# EAGLE design DAWA-MPU 6.3 (EAGLE 9.5.0)
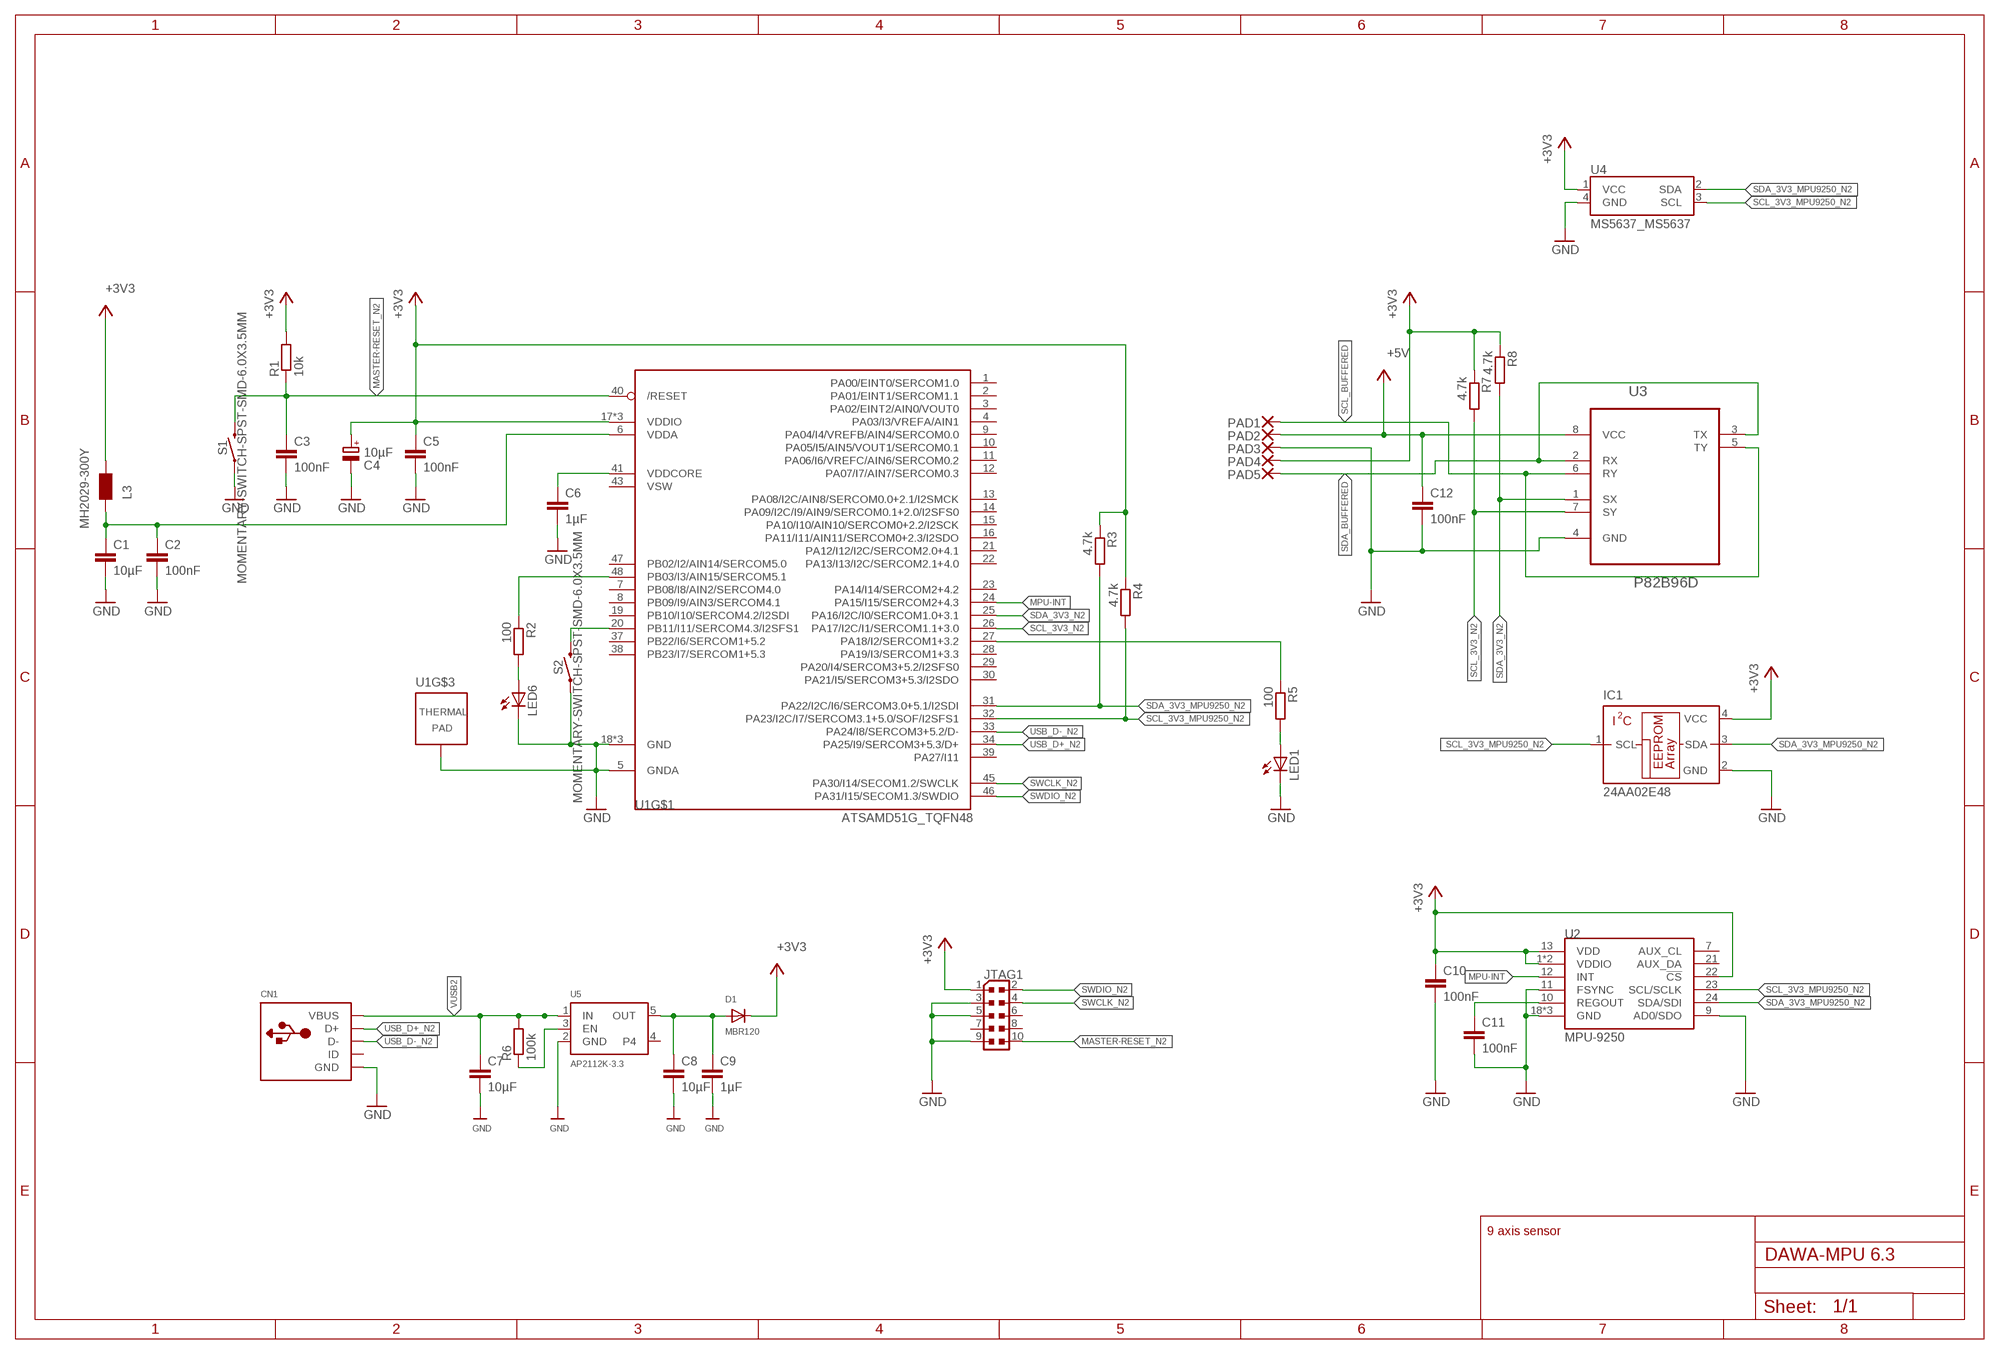
[diagram p0: schematic, sheet 1]

## Parts
C1  10µF  C-EUC0805  [C0805]
C2  100nF  C-EUC0603  [C0603]
C3  100nF  C-EUC0603  [C0603]
C4  10µF  CPOL-EUSMCB  [SMC_B]
C5  100nF  C-EUC0603  [C0603]
C6  1µF  C-EUC0603  [C0603]
C7  10µF  C-EUC0603  [C0603]
C8  10µF  C-EUC0603  [C0603]
C9  1µF  C-EUC0603  [C0603]
C10  100nF  C-EUC0603  [C0603]
C11  100nF  C-EUC0603  [C0603]
C12  100nF  C-EUC0603  [C0603]
CN1  USB  [USB-MINIB-DAWA]
D1  MBR120  DIODE_SOD-123FL  [SOD-123FL]
IC1  24AA02E48  24AA00OT  [SOT23-5L]
JTAG1  PINHEAD_PINHD-2X5PASSO127  [PINHEAD_2X05_127]
L3  MH2029-300Y  WE-CBF_0805  [0805]
LED1  LEDCHIPLED_1206  [CHIPLED_1206]
LED6  LEDCHIPLED_1206  [CHIPLED_1206]
PAD1  WIREPAD1,6/0,9  [1,6/0,9]
PAD2  WIREPAD1,6/0,9  [1,6/0,9]
PAD3  WIREPAD1,6/0,9  [1,6/0,9]
PAD4  WIREPAD1,6/0,9  [1,6/0,9]
PAD5  WIREPAD1,6/0,9  [1,6/0,9]
R1  10k  R-EU_R0603  [R0603]
R2  100  R-EU_R0603  [R0603]
R3  4.7k  R-EU_R0603  [R0603]
R4  4.7k  R-EU_R0603  [R0603]
R5  100  R-EU_R0603  [R0603]
R6  100k  R-EU_R0603  [R0603]
R7  4.7k  R-EU_R0603  [R0603]
R8  4.7k  R-EU_R0603  [R0603]
S1  MOMENTARY-SWITCH-SPST-SMD-6.0X3.5MM  [TACTILE_SWITCH_SMD_6.0X3.5MM]
S2  MOMENTARY-SWITCH-SPST-SMD-6.0X3.5MM  [TACTILE_SWITCH_SMD_6.0X3.5MM]
U1  ATSAMD51G_TQFN48  [TQFN48_7MM]
U2  MPU-9250  [QFN24_PAD]
U3  P82B96D  [SOIC127P600X175-8N]
U4  MS5637_MS5637  [MS5637_MS5637]
U5  AP2112K-3.3  VREG_SOT23-5  [SOT23-5]

## Nets
+3V1: R2.1 U1.48(PB03/I3/AIN15/SERCOM5.1)
+3V2: R5.1 U1.27(PA18/I2/SERCOM1+3.2)
+3V3: C4.+ C5.1 C10.1 D1.C IC1.4(VCC) JTAG1.1 L3.1 PAD4.1(P) R1.2 R3.1 R4.1 R7.1 R8.1 U1.17(VDDIO) U1.36(VDDIO) U1.44(VDDIO) U2.1(VDDIO) U2.8(VDDIO) U2.13(VDD) U2.22(!CS) U4.1(VCC)
+5V: C12.1 PAD2.1(P) U3.8(VCC)
GND: C1.2 C2.2 C3.2 C4.- C5.2 C6.2 C7.2 C8.2 C9.2 C10.2 C11.2 C12.2 CN1.GND CN1.GND1(GND) CN1.GND2(GND) IC1.2(GND) JTAG1.3 JTAG1.5 JTAG1.9 LED1.C LED6.C PAD3.1(P) S1.1 S2.1 U1.5(GNDA) U1.18(GND) U1.35(GND) U1.42(GND) U1.THERMAL(TP) U2.9(AD0/SDO) U2.11(FSYNC) U2.18(GND) U2.20(GND) U2.CENTER(GND) U3.4(GND) U4.4(GND) U5.2(GND)
MASTER-RESET_N2: C3.1 JTAG1.10 R1.1 S1.2 U1.40(/RESET)
MPU-INT: U1.24(PA15/I15/SERCOM2+4.3) U2.12(INT)
N$1: LED1.A R5.2
N$9: C6.1 U1.41(VDDCORE)
N$16: S2.2 U1.20(PB11/I11/SERCOM4.3/I2SFS1)
N$17: LED6.A R2.2
N$47: R6.1 U5.3(EN)
OUT: C8.1 C9.1 D1.A U5.5(OUT)
REGOUT: C11.1 U2.10(REGOUT)
SCL_3V3_MPU9250_N2: IC1.1(SCL) R4.2 U1.32(PA23/I2C/I7/SERCOM3.1+5.0/SOF/I2SFS1) U2.23(SCL/SCLK) U4.3(SCL)
SCL_3V3_N2: R7.2 U1.26(PA17/I2C/I1/SERCOM1.1+3.0) U3.7(SY)
SCL_BUFFERED: PAD1.1(P) U3.5(TY) U3.6(RY)
SDA_3V3_MPU9250_N2: IC1.3(SDA) R3.2 U1.31(PA22/I2C/I6/SERCOM3.0+5.1/I2SDI) U2.24(SDA/SDI) U4.2(SDA)
SDA_3V3_N2: R8.2 U1.25(PA16/I2C/I0/SERCOM1.0+3.1) U3.1(SX)
SDA_BUFFERED: PAD5.1(P) U3.2(RX) U3.3(TX)
SWCLK_N2: JTAG1.4 U1.45(PA30/I14/SECOM1.2/SWCLK)
SWDIO_N2: JTAG1.2 U1.46(PA31/I15/SECOM1.3/SWDIO)
USB_D+_N2: CN1.D+ U1.34(PA25/I9/SERCOM3+5.3/D+)
USB_D-_N2: CN1.D- U1.33(PA24/I8/SERCOM3+5.2/D-)
VDDANA1: C1.1 C2.1 L3.2 U1.6(VDDA)
VUSB2: C7.1 CN1.VBUS R6.2 U5.1(IN)
Unconnected: CN1.ID JTAG1.6 JTAG1.7 JTAG1.8 U1.1(PA00/EINT0/SERCOM1.0) U1.2(PA01/EINT1/SERCOM1.1) U1.3(PA02/EINT2/AIN0/VOUT0) U1.4(PA03/I3/VREFA/AIN1) U1.7(PB08/I8/AIN2/SERCOM4.0) U1.8(PB09/I9/AIN3/SERCOM4.1) U1.9(PA04/I4/VREFB/AIN4/SERCOM0.0) U1.10(PA05/I5/AIN5/VOUT1/SERCOM0.1) U1.11(PA06/I6/VREFC/AIN6/SERCOM0.2) U1.12(PA07/I7/AIN7/SERCOM0.3) U1.13(PA08/I2C/AIN8/SERCOM0.0+2.1/I2SMCK) U1.14(PA09/I2C/I9/AIN9/SERCOM0.1+2.0/I2SFS0) U1.15(PA10/I10/AIN10/SERCOM0+2.2/I2SCK) U1.16(PA11/I11/AIN11/SERCOM0+2.3/I2SDO) U1.19(PB10/I10/SERCOM4.2/I2SDI) U1.21(PA12/I12/I2C/SERCOM2.0+4.1) U1.22(PA13/I13/I2C/SERCOM2.1+4.0) U1.23(PA14/I14/SERCOM2+4.2) U1.28(PA19/I3/SERCOM1+3.3) U1.29(PA20/I4/SERCOM3+5.2/I2SFS0) U1.30(PA21/I5/SERCOM3+5.3/I2SDO) U1.37(PB22/I6/SERCOM1+5.2) U1.38(PB23/I7/SERCOM1+5.3) U1.39(PA27/I11) U1.47(PB02/I2/AIN14/SERCOM5.0) U2.7(AUX_CL) U2.21(AUX_DA) U5.4

## Notes on the sheet
- 9 axis sensor

## Power pins joined to a net without a drawn wire
VSW: U1.43(VSW)

## Library data of the parts
C1-C3 C5-C11 = rcl:C-EU: CAPACITOR, European symbol; SPICEPREFIX: C
C4 = rcl:CPOL-EU: POLARIZED CAPACITOR, European symbol; SPICEPREFIX: C
C12 = rcl:C-EU: CAPACITOR, European symbol
CN1 = DAWA:USB: USB Connectors USBMINIB - Surface Mount Female Mini-B USB Connector 4UConnector: 06564 By microbuilder.eu Thru-hole RA Female Mini-B USB Connector 4UConnector: 18732 By ladyada.net
D1 = adafruit:DIODE: Diode SMADIODE - SMA Surface Mount Package 20V 1A Schottky Diode Digikey: 641-1014-6-ND DO-1N4148 - Through Hole Small Current Diode SOD-123 20V 1 A (.5mV Vf) Schottky Diode - Digikey: MBRX120TPMSCT-ND SOD-323 10V 570mA (.38mV Vf, 3ns) Schottky Diode - Digikey: ZLLS410CT-ND SOD-523 30V 30mA Schottky Diode (RB751S-40TE61) - Digikey: RB751S-40TE61CT-ND SOT23-R/W - SOT23 Package (R = Solder Paste/Reflow Ovens, W = Hand-Soldering) BAT54Film 40V 300mA - Digikey: 497-7162-1-ND
IC1 = microchip:24*00: Serial EEPROM 128 bit, I2C (AA = 1.8 V/LC = 2.5 V/C = 5.0 V); MF: MICROCHIP; MPN: 24AA00T-I/OTG; OC_FARNELL: 1331264; OC_NEWARK: 89H3038
JTAG1 = Arduino_Wifi_shield_v018_tG:PINHEAD_PINHD-2X5: PIN HEADER
L3 = wuerth-elektronik:WE-CBF: SMD EMI Suppression Ferrite Beads - excellent anti-EMI properties - low DCR - impedances till 3000 ohms - rated current up to 6 A
LED1 LED6 = adafruit:LED: LED OSRAM: - CHIPLED LG R971, LG N971, LY N971, LG Q971, LY Q971, LO R971, LY R971 LH N974, LH R974 LS Q976, LO Q976, LY Q976 LO Q996 - Hyper CHIPLED LW Q18S LB Q993, LB Q99A, LB R99A - SideLED LS A670, LO A670, LY A670, LG A670, LP A670 LB A673, LV A673, LT A673, LW A673 LH A674 LY A675 LS A676, LA A676, LO A676, LY A676, LW A676 LS A679, LY A679, LG A679 - Hyper Micro SIDELED® LS Y876, LA Y876, LO Y876, LY Y876 LT Y87S - SmartLED LW L88C, LW L88S LB L89C, LB L89S, LG L890 LS L89K, LO L89K, LY L89K LS L896, LA L896, LO L896, LY L896 - TOPLED LS T670, LO T670, LY T670, LG T670, LP T670 LSG T670, LSP T670, LSY T670, LOP T670, LYG T670 LG T671, LOG T671, LSG T671 LB T673, LV T673, LT T673, LW T673 LH T674 LS T676, LA T676, LO T676, LY T676, LB T676, LH T676, LSB T676, LW T676 LB T67C, LV T67C, LT T67C, LS T67K, LO T67K, LY T67K, LW E67C LS E67B, LA E67B, LO E67B, LY E67B, LB E67C, LV E67C, LT E67C LW T67C LS T679, LY T679, LG T679 LS T770, LO T770, LY T770, LG T770, LP T770 LB T773, LV T773, LT T773, LW T773 LH T774 LS E675, LA E675, LY E675, LS T675 LS T776, LA T776, LO T776, LY T776, LB T776 LHGB T686 LT T68C, LB T68C - Hyper Mini TOPLED® LB M676 - Mini TOPLED Santana® LG M470 LS M47K, LO M47K, LY M47K Source: http://www.osram.convergy.de/
PAD1-PAD5 = wirepad:WIREPAD: Wire PAD connect wire on PCB
R1 R6 = rcl:R-EU_: RESISTOR, European symbol; SPICEPREFIX: R
R2-R5 R7 R8 = resistor:R-EU_: RESISTOR, European symbol
S1 S2 = SparkFun-Switches:MOMENTARY-SWITCH-SPST: Momentary Switch (Pushbutton) - SPST Normally-open (NO) SPST momentary switches (buttons, pushbuttons). Variants PTH-12MM - 12mm square, through-hole Momentary Pushbutton Switch - 12mm Square <https://www.sparkfun.com/products/9190> (COM-09190) PTH-6.0MM, PTH-6.0MM-KIT - 6.0mm square, through-hole Mini Pushbutton Switch <https://www.sparkfun.com/products/97> (COM-00097) KIT package intended for soldering kit's - only one side of pads' copper is exposed. PTH-RIGHT-ANGLE-KIT - Right-angle, through-hole Right Angle Tactile Button <https://www.sparkfun.com/products/10791> - Used on SparkFun BigTime Watch Kit <https://www.sparkfun.com/products/11734> SMD-12MM - 12mm square, surface-mount Tactile Button - SMD (12mm) <https://www.sparkfun.com/products/12993> (COM-12993) Used on SparkFun PicoBoard <https://www.sparkfun.com/products/11888> SMD-4.5MM - 4.5mm Square Trackball Switch Used on SparkFun Blackberry Trackballer Breakout <https://www.sparkfun.com/products/13169> SMD-4.6MMX2.8MM - 4.60mm x 2.80mm, surface mount Used on SparkFun SAMD21 Mini Breakout <https://www.sparkfun.com/products/13664> SMD-5.2MM, SMD-5.2-REDUNDANT - 5.2mm square, surface-mount Mini Pushbutton Switch - SMD <https://www.sparkfun.com/products/8720> (COM-08720) Used on Arduino Pro Mini <https://www.sparkfun.com/products/11114> REDUNDANT package connects both switch circuits together SMD-6.0X3.5MM - 6.0 x 3.5mm, surface mount Momentary Reset Switch SMD <https://www.sparkfun.com/products/8229> (COM-08229) SMD-6.2MM-TALL - 6.2mm square, surface mount Tactile Button - SMD (6mm) <https://www.sparkfun.com/products/12992> Used on SparkFun Digital Sandbox <https://www.sparkfun.com/products/12651> SMD-RIGHT-ANGLE - Right-angle, surface mount Used on SparkFun Block for Intel® Edison - Arduino <https://www.sparkfun.com/products/13036>; PROD_ID: SWCH-00815; SF_SKU: COM-08229
U1 = microbuilder:ATSAMD51G
U2 = Testing:MPU-9250: NC pin 19. 2-6 & 14-17 not internally connected. May be used for PCB trace routing.; PROD_ID: IC-13192
U3 = TI:P82B96D: DUAL BIDIRECTIONAL BUS BUFFER; MPN: P82B96D; OC_FARNELL: 1831235; OC_NEWARK: 88K6383; PACKAGE: SOIC-8; SUPPLIER: Texas Instruments
U4 = MS5637:MS5637_MS5637
U5 = microbuilder:VREG_SOT23-5: SOT23-5 Fixed Voltage Regulators Part Current Out V Out V In V Dropout θJA (°C/W) TJ (°C) Digikey Part No. ADP121 150mA 3.3V 3.4-5.5V 0.09V @ 150mA -- -- ADP121-AUJZ33R7CT-ND ADP121 150mA 3.0V 3.1-5.5V 0.09V @ 150mA -- -- ADP121-AUJZ30R7CT-ND ADP122 300mA 3.3V 3.4-5.5V 0.085V @ 300mA -- -- ADP122AUJZ-3.3-R7CT-ND ADP1712 300mA 3.3V 3.5-5.5V 0.17V @ 300mA -- -- ADP1712AUJZ-3.3-R7TR-ND AP7311 (Low Cost) 150mA 3.3V 3.5-6V 0.15V @ 150mA -- -- AP7311-33WG-7DICT-ND LD39015M18R 150mA 1.8V 1.9V-5.5V 0.08V @ 100mA -- -- 497-6977-1-ND LP2985A-33DBVR 150mA 3.3V 3.3-16V 0.28V @ 150mA 206 150 296-18479-1-ND MCP1824T-3302E/OT 300mA 3.3V 3.5V-6V 0.2V @ 300mA -- -- MCP1824T-3302E/OTCT-ND MIC5205-2.5YM5 TR 150mA 2.5V 2.7-16V 0.165V @ 150mA -- -- 576-1257-2-ND MIC5205-3.0YM5 TR 150mA 3.0V 3.2V-16V 0.165V @ 150mA -- -- 576-1258-2-ND MIC5205-3.3YM5 TR 150mA 3.3V 3.5V-16V 0.165V @ 150mA -- -- 576-1259-2-ND TPS780330220 150mA 3.3V+2.2V 3.6-5.5V 250mV Max -- -- 296-23332-1-ND TDA3663/N1,135 100mA 3.3V 3.5-45V 0.18V @ 50mA -- -- 568-5343-1-ND Max operating temp can be calculated using θJA, TJ (max junction temperature), and power in watts. Set the "Maximum Ambient Temperature" until it reaches TJ ("Max Junction Temperature"), which is the absolute limit for safe use of the regulator: Heat Sink Temperature Calculator <http://www.daycounter.com/Calculators/Heat-Sink-Temperature-Calculator.phtml> For example, With 12V source into a 3.3V LP2985 and a 30mA load, we are dissipating (12V-3.3V) * 0.03A = 0.261W. With a θJA of 206 °C/W, a TJ of 150°C, and 261mW we can safely use the chip without a heat sink up to 75°C (=147.1°C Junction Temperature).

## Net classes
0 default: width 0.203 mm, drill 0.406 mm, clearance 0.203 mm
3 usbvcc: width 0.203 mm, drill 0.406 mm, clearance 0.203 mm
4 USBpair: width 0.254 mm, drill 0.406 mm, clearance 0.61 mm

## Board
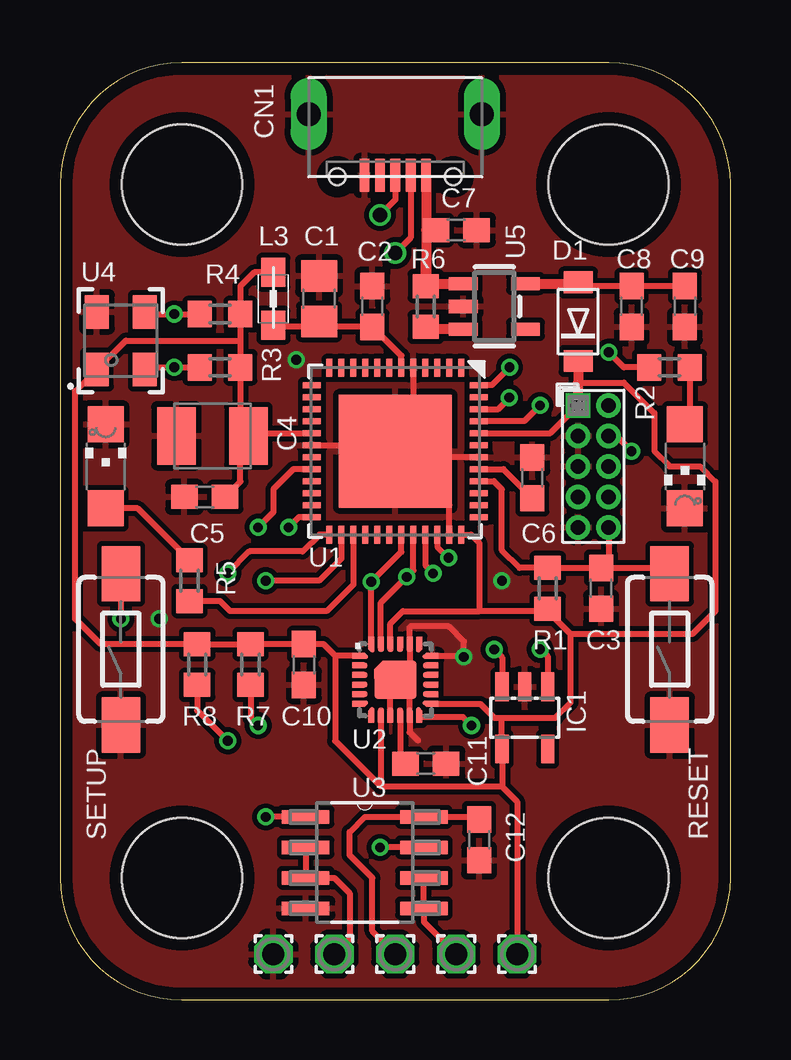
[diagram p1: board, top side]
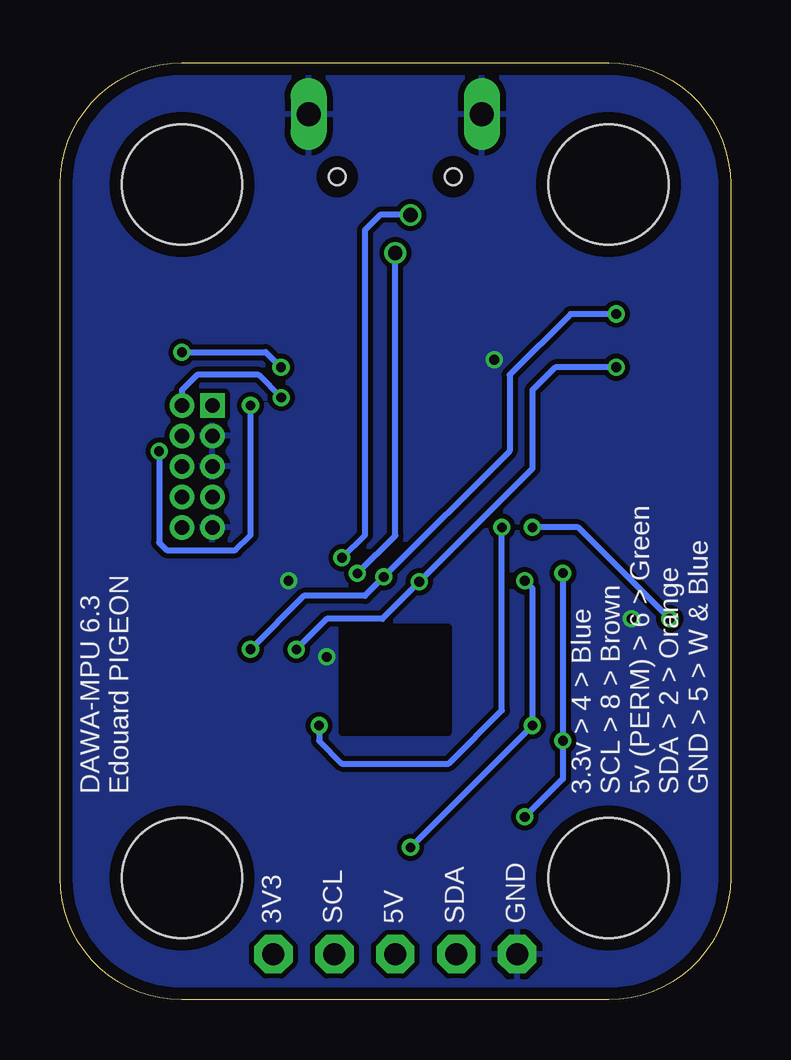
[diagram p2: board, bottom side, seen from below]

Size 27.94 x 39.05 mm. Coordinates in mm from the lower left corner, seen from the top.
Outline: 5.08,39.05 arc90 0,33.97 0,5.08 arc90 5.08,0 22.86,0 arc90 27.94,5.08 27.94,33.97 arc90 22.86,39.05 5.08,39.05
Copper layers (1*16): Top 0.035mm / dielectric 1.6mm / Bottom 0.035mm
Design rules "Elecrow_2-layer_PCB_eagle_rule": minimum track width 6mil, minimum drill 12mil, track to track 6mil, track to pad 6mil, pad to pad 6mil, via to via 8mil, smd to smd 0mil, copper to edge 20mil, drill to drill 10mil, minimum pad ring 6mil, minimum via ring 6mil, stop-mask expansion 0mil, vias tented up to drill 100mil, thermal gap 10mil
Holes 5 mm at 22.86,33.97 5.08,33.97 22.86,5.08 5.08,5.08

### Footprints (pad centres in the part's own frame; a part is rotated, then mirrored left to right if it is on the bottom)
C0805 = smd 1.3 x 1.5: 1 -0.95,0; 2 0.95,0
C0603 = smd 1.1 x 1: 1 -0.85,0; 2 0.85,0
SMC_B = smd 1.6 x 2.4: + -1.5,0; - 1.5,0
USB-MINIB-DAWA = smd 0.406 x 1.372: D+ 0,4.381; D- -0.641,4.381; GND 1.282,4.381; ID 0.641,4.381; VBUS -1.282,4.381 | drill 1 long: GND1 -3.612,1.826; GND2 3.612,1.826 | hole 0.7: -2.421,4.445; 2.421,4.445
SOD-123FL = smd 0.91 x 1.22: A 1.637,0; C -1.637,0
SOT23-5L = smd 0.55 x 1.2: 1 -0.95,-1.3; 2 0,-1.3; 3 0.95,-1.3; 4 0.95,1.3; 5 -0.95,1.3
PINHEAD_2X05_127 = drill 0.6 pad 1.016 square: 1 -0.635,2.54 | drill 0.6 pad 1.016: 2 0.635,2.54; 3 -0.635,1.27; 4 0.635,1.27; 5 -0.635,0; 6 0.635,0; 7 -0.635,-1.27; 8 0.635,-1.27; 9 -0.635,-2.54; 10 0.635,-2.54
0805 = smd 1.2 x 1: 1 -1.1,0; 2 1.1,0
CHIPLED_1206 = smd 1.5 x 1.5: A 0,-1.75; C 0,1.75
1,6/0,9 = drill 0.914 pad 1.6 octagon: 1 0,0
R0603 = smd 1 x 1.1: 1 -0.85,0; 2 0.85,0
TACTILE_SWITCH_SMD_6.0X3.5MM = smd 2.3 x 1.6: 1 -3.15,0; 2 3.15,0
TQFN48_7MM = smd 0.25 x 0.75: 1 -2.75,-3.475; 2 -2.25,-3.475; 3 -1.75,-3.475; 4 -1.25,-3.475; 5 -0.75,-3.475; 6 -0.25,-3.475; 7 0.25,-3.475; 8 0.75,-3.475; 9 1.25,-3.475; 10 1.75,-3.475; 11 2.25,-3.475; 12 2.75,-3.475; 25 2.75,3.475; 26 2.25,3.475; 27 1.75,3.475; 28 1.25,3.475; 29 0.75,3.475; 30 0.25,3.475; 31 -0.25,3.475; 32 -0.75,3.475; 33 -1.25,3.475; 34 -1.75,3.475; 35 -2.25,3.475; 36 -2.75,3.475 | smd 0.75 x 0.25: 13 3.475,-2.75; 14 3.475,-2.25; 15 3.475,-1.75; 16 3.475,-1.25; 17 3.475,-0.75; 18 3.475,-0.25; 19 3.475,0.25; 20 3.475,0.75; 21 3.475,1.25; 22 3.475,1.75; 23 3.475,2.25; 24 3.475,2.75; 37 -3.475,2.75; 38 -3.475,2.25; 39 -3.475,1.75; 40 -3.475,1.25; 41 -3.475,0.75; 42 -3.475,0.25; 43 -3.475,-0.25; 44 -3.475,-0.75; 45 -3.475,-1.25; 46 -3.475,-1.75; 47 -3.475,-2.25; 48 -3.475,-2.75 | smd 4.7 x 4.7: THERMAL 0,0
QFN24_PAD = smd 0.5 x 0.25: 1 -1.55,1; 2 -1.55,0.6; 3 -1.55,0.2; 4 -1.55,-0.2; 5 -1.55,-0.6; 6 -1.55,-1; 13 1.55,-1; 14 1.55,-0.6; 15 1.55,-0.2; 16 1.55,0.2; 17 1.55,0.6; 18 1.55,1 | smd 0.08 x 0.13: 1$1 -1.32,1.06; 1$3 -1.26,0.94; P$33 1.26,-0.94; P$34 1.32,-1.06; P$58 1.26,0.94; P$59 1.32,1.06; P$68 -1.26,-0.94; P$69 -1.32,-1.06 | smd 0.1 x 0.185 rotated 45: 1$2 -1.25,1.024; P$49 1.024,-1.25 | smd 0.14 x 0.14: 1$4 -1.22,0.945; P$23 -0.945,-1.22; P$24 1.22,-0.945; P$36 0.945,1.22; P$51 0.945,-1.22; P$56 1.22,0.945; P$61 -0.945,1.22; P$66 -1.22,-0.945 | smd 0.05 x 0.05: 1$5 -1.175,0.97; P$25 -0.97,-1.175; P$31 1.175,-0.97; P$37 0.97,1.175; P$52 0.97,-1.175; P$57 1.175,0.97; P$62 -0.97,1.175; P$67 -1.175,-0.97 | smd 0.25 x 0.5: 7 -1,-1.55; 8 -0.6,-1.55; 9 -0.2,-1.55; 10 0.2,-1.55; 11 0.6,-1.55; 12 1,-1.55; 19 1,1.55; 20 0.6,1.55; 21 0.2,1.55; 22 -0.2,1.55; 23 -0.6,1.55; 24 -1,1.55 | smd 0.25 x 0.25: CENTER 0,0 | smd 0.4 x 0.4: DBBADFE -0.675,0.24 | smd 0.6 x 1.2: DBBADFE1 -0.575,-0.195 | smd 0.25 x 0.3: P$1 -0.2,1.3; P$3 0.2,1.3; P$5 0.6,1.3; P$11 -0.6,1.3; P$16 0.2,-1.3; P$18 -0.2,-1.3; P$20 -0.6,-1.3; P$26 0.6,-1.3 | smd 0.3 x 0.25: P$2 -1.3,0.2; P$4 -1.3,0.6; P$28 -1.3,-0.2; P$38 -1.3,-0.6; P$40 1.3,0.2; P$42 1.3,-0.2; P$44 1.3,-0.6; P$50 1.3,0.6 | smd 0.1 x 0.185 rotated 225: P$7 1.25,-1.024; P$60 -1.024,1.25 | smd 1.1 x 1.59: P$13 0.325,0 | smd 0.3 x 0.5 rotated 315: P$14 -0.592,0.512 | smd 0.5 x 1.59: P$15 -0.27,0 | smd 0.1 x 0.185 rotated 135: P$22 -1.024,-1.25; P$55 1.25,1.024 | smd 0.13 x 0.08: P$27 -0.94,-1.26; P$29 -1.06,-1.32; P$39 0.94,1.26; P$41 1.06,1.32; P$53 0.94,-1.26; P$54 1.06,-1.32; P$63 -0.94,1.26; P$64 -1.06,1.32 | smd 0.1 x 0.185 rotated 315: P$35 1.024,1.25; P$65 -1.25,-1.024
SOIC127P600X175-8N = smd 1.981 x 0.559: 1 -2.464,1.905; 2 -2.464,0.635; 3 -2.464,-0.635; 4 -2.464,-1.905; 5 2.464,-1.905; 6 2.464,-0.635; 7 2.464,0.635; 8 2.464,1.905
MS5637_MS5637 = smd 1.4 x 1: 1 -1.2,1; 2 -1.2,-1; 3 1.2,-1; 4 1.2,1
SOT23-5 = smd 0.55 x 1.2: 1 -0.95,-1.3; 2 0,-1.3; 3 0.95,-1.3; 4 0.95,1.3; 5 -0.95,1.3

### Placement (x,y rotation side)
C1  10.79,29.21 90 top
C2  13.02,28.89 90 top
C3  22.54,17.14 270 top
C4  6.35,23.5 180 top
C5  6.03,20.95 180 top
C6  19.68,21.75 90 top
C7  16.51,32.07 0 top
C8  23.81,28.89 270 top
C9  26.03,28.89 270 top
C10  10.16,13.97 270 top
C11  15.24,9.84 0 top
C12  17.46,6.67 270 top
CN1  13.97,38.73 180 top
D1  21.59,28.26 90 top
IC1  19.37,11.75 180 top
JTAG1  22.22,22.22 0 top
L3  8.89,29.21 270 top
LED1  1.91,22.22 0 top
LED6  26.03,22.22 180 top
PAD1  16.51,1.91 0 top
PAD2  13.97,1.91 0 top
PAD3  8.89,1.91 0 top
PAD4  19.05,1.91 0 top
PAD5  11.43,1.91 0 top
R1  20.32,17.14 270 top
R2  25.4,26.35 0 top
R3  6.67,26.35 180 top
R4  6.67,28.58 180 top
R5  5.4,17.46 90 top
R6  15.24,28.89 90 top
R7  7.94,13.97 270 top
R8  5.71,13.97 270 top
S1  25.4,14.61 90 top
S2  2.54,14.61 90 top
U1  13.97,22.86 180 top
U2  13.97,13.33 0 top
U3  12.7,5.72 0 top
U4  2.54,27.46 90 top
U5  18.1,28.89 270 top

### Tracks (layer width: path | path; a pad name or v marks a point on that pad's centre or on a via)
+3V1  (via drill 0.41)
  Top 0.254: R2.1 23.49,26.35 v22.86,26.99 | v18.73,26.35 17.99,25.61 U1.48
  Bottom 0.254: v22.86,26.99 19.37,26.99 v18.73,26.35
+3V2
  Top 0.254: U1.27 12.22,17.3 11.11,16.19 7.09,16.19 6.67,16.61 R5.1
+3V3
  Top 0.254: U2.22 13.77,15.67 14.29,16.19 17.46,16.19 | U1.36 17.13,19.39 17.46,19.05 17.46,16.19 | U1.44 20.43,23.61 JTAG1.1 | 21.59,25.72 23.49,25.72 24.77,24.45 24.77,22.86 25.4,22.22 26.67,22.22 27.3,21.59 27.3,16.19 26.35,15.24 21.27,15.24 | 21.27,15.24 21.27,12.38 20.64,11.75 18.41,11.75 | U2.1 11.47,14.33 | 11.47,14.33 10.98,14.82 C10.1 R7.1 R8.1 1.69,14.82 0.63,15.88 0.63,25.36 U4.1 2.74,27.46 7.52,27.46 | 7.52,27.46 R4.1 7.52,29.74 8.08,30.31 L3.1 | 7.52,27.46 R3.1 7.52,23.5 | 7.52,23.5 C4.+ 7.96,23.61 U1.17 | U2.8 13.37,8.89 | 13.37,8.89 18.41,8.89 | 17.46,16.19 20.22,16.19 R1.2 20.32,16.19 21.27,15.24 | C5.1 7.52,21.59 7.52,23.5 | U2.13 17.51,12.33 18.1,11.75 18.41,11.75 | 18.41,11.75 IC1.4 18.42,8.89 18.41,8.89 | 18.41,8.89 19.05,8.25 PAD4.1 | 11.47,14.33 11.47,10.79 13.37,8.89
  Top 0.406: D1.C 21.59,25.72 JTAG1.1
+5V
  Top 0.254: PAD2.1 13.02,2.86 13.02,5.08 12.07,6.03 12.07,6.98 12.7,7.62 U3.8 17.36,7.62 C12.1
GND  (via drill 0.41)
  Top 0.254: U2.CENTER 14.57,13.94 U2.20 14.57,15.52 14.6,15.56 16.19,15.56 16.83,14.92 v16.83,14.29 16.78,14.33 U2.18 | U2.9 13.77,13.14 U2.CENTER | U2.CENTER 14.57,12.73 U2.11 14.57,11.15 14.92,10.8 | U1.5 14.72,23.61 U1.THERMAL | U1.18 13.72,23.11 U1.THERMAL | U1.42 14.22,22.61 U1.THERMAL | U1.35 16.22,20.61 U1.THERMAL
  other vias: 18.41,17.46 9.84,26.67 4.13,15.88
  pour Bottom: 27.94,33.97 arc90 22.86,39.05 5.08,39.05 arc90 0,33.97 0,5.08 arc90 5.08,0 22.86,0 arc90 27.94,5.08
  pour Top: 22.86,39.05 5.08,39.05 arc90 0,33.97 0,5.08 arc90 5.08,0 22.86,0 arc90 27.94,5.08 27.94,33.97 arc90
  cutout Bottom: 16.19,15.56 11.75,15.56 11.75,11.11 16.19,11.11
MASTER-RESET_N2
  Top 0.254: C3.1 R1.1 19.15,18 18.41,18.73 18.41,21.27 18.08,21.61 U1.40 | C3.1 25.16,18 S1.2 | JTAG1.10 22.86,18 C3.1
MPU-INT  (via drill 0.41)
  Top 0.254: U1.24 9.95,20.11 v9.52,19.69 | U2.12 16.79,11.78 v17.15,11.43
  Bottom 0.254: v9.52,19.69 9.52,12.06 11.75,9.84 16.19,9.84 17.15,10.8 v17.15,11.43
N$1
  Top 0.254: R5.2 3.24,20.47 LED1.A
N$9
  Top 0.254: U1.41 18.47,22.11 C6.1
N$16  (via drill 0.41)
  Top 0.254: U1.20 9.73,22.11 8.89,21.27 8.89,20.32 v8.26,19.69 | S2.2 v2.54,15.88
  Bottom 0.254: v2.54,15.88 6.35,19.69 v8.26,19.69
N$17
  Top 0.254: LED6.A 26.25,24.19 R2.2
N$47
  Top 0.406: U5.3 15.24,27.94 R6.1
OUT
  Top 0.254: C9.1 C8.1 21.74,29.74 21.62,29.87 D1.A
  Top 0.406: U5.5 21.59,29.84 21.62,29.87
REGOUT
  Top 0.254: U2.10 14.17,10.06 C11.1
SCL_3V3_MPU9250_N2  (via drill 0.41)
  Top 0.254: U4.3 3.63,28.58 v4.76,28.58 R4.2 | v20,14.61 20.03,14.61 20.32,14.32 IC1.1 | U1.32 14.72,17.89 v14.45,17.62 13.37,16.55 U2.23
  Bottom 0.254: v20,14.61 17.78,16.83 15.24,16.83 v14.45,17.62 9.21,22.86 9.21,26.03 6.67,28.58 v4.76,28.58
SCL_3V3_N2  (via drill 0.41)
  Top 0.254: U1.26 11.72,18.39 10.79,17.46 v8.57,17.46 | U3.7 v13.33,6.35 | R7.2 7.94,11.75 v8.26,11.43
  Bottom 0.254: v8.57,17.46 8.26,17.14 v8.26,11.43 v13.33,6.35
SCL_BUFFERED
  Top 0.254: U3.6 U3.5 15.16,3.25 PAD1.1
SDA_3V3_MPU9250_N2  (via drill 0.41)
  Top 0.254: U1.31 14.22,18.67 v12.97,17.42 U2.24 | v18.09,14.6 18.42,14.27 IC1.3 | R3.2 v4.76,26.35 3.63,26.35 U4.2
  Bottom 0.254: v4.76,26.35 7.3,26.35 8.26,25.4 8.26,22.13 v12.97,17.42 14.51,15.88 16.83,15.88 v18.1,14.61 v18.09,14.6
SDA_3V3_N2  (via drill 0.41)
  Top 0.254: v6.99,17.78 7.89,18.68 10.11,18.68 10.81,19.39 U1.25 | U3.1 v8.57,7.62 | R8.2 5.71,12.06 v6.99,10.8
  Bottom 0.254: v6.99,17.78 v6.99,10.8 6.99,9.21 v8.57,7.62
SDA_BUFFERED
  Top 0.254: U3.2 U3.3 11.43,5.08 12.07,4.44 12.07,2.54 PAD5.1
SWCLK_N2  (via drill 0.41)
  Top 0.254: JTAG1.4 23.18,23.5 v23.81,22.86 | v20,24.77 19.35,24.11 U1.45
  Bottom 0.254: v23.81,22.86 23.81,19.05 23.49,18.73 20.64,18.73 20,19.37 v20,24.77
SWDIO_N2  (via drill 0.41)
  Top 0.254: U1.46 18.26,24.61 18.73,25.08 v18.72,25.09
  Bottom 0.254: v18.72,25.09 19.66,26.03 22.23,26.03 22.86,25.4 JTAG1.2
USB_D+_N2  (via drill 0.41, 0.6)
  Top 0.254: CN1.D+ 13.97,33.34 v13.33,32.7 | U1.34 15.72,18.89 v16.19,18.42
  Bottom 0.254: v16.19,18.42 15.24,19.37 15.24,32.07 14.6,32.7 v13.33,32.7
USB_D-_N2  (via drill 0.41, 0.6)
  Top 0.254: CN1.D- 14.61,31.76 v13.97,31.11 | U1.33 15.22,18.12 v15.56,17.78 v15.55,17.77
  Bottom 0.254: v15.55,17.77 13.97,19.34 v13.97,31.11
VDDANA1
  Top 0.254: U1.6 14.22,26.84 C2.1 10.79,28.04 | 10.79,28.04 8.96,28.04 L3.2 | C1.1 10.79,28.04
VUSB2
  Top 0.406: CN1.VBUS 15.25,32.07 | 15.25,32.07 15.25,30.8 | 15.25,30.8 15.25,29.84 U5.1 | C7.1 15.25,32.07 | R6.2 15.24,30.8 15.25,30.8

### Text on the board
tNames: . | SETUP | RESET
bNames: 3.3v > 4 > Blue / SCL > 8 > Brown / 5v (PERM) > 6 > Green / SDA > 2 > Orange / GND > 5 > W & Blue | DAWA-MPU 6.3 / Edouard PIGEON | GND | SDA | 5V | SCL | 3V3